# EAGLE design PumpSpark (EAGLE 6.4)

## Sheet 1 of 2
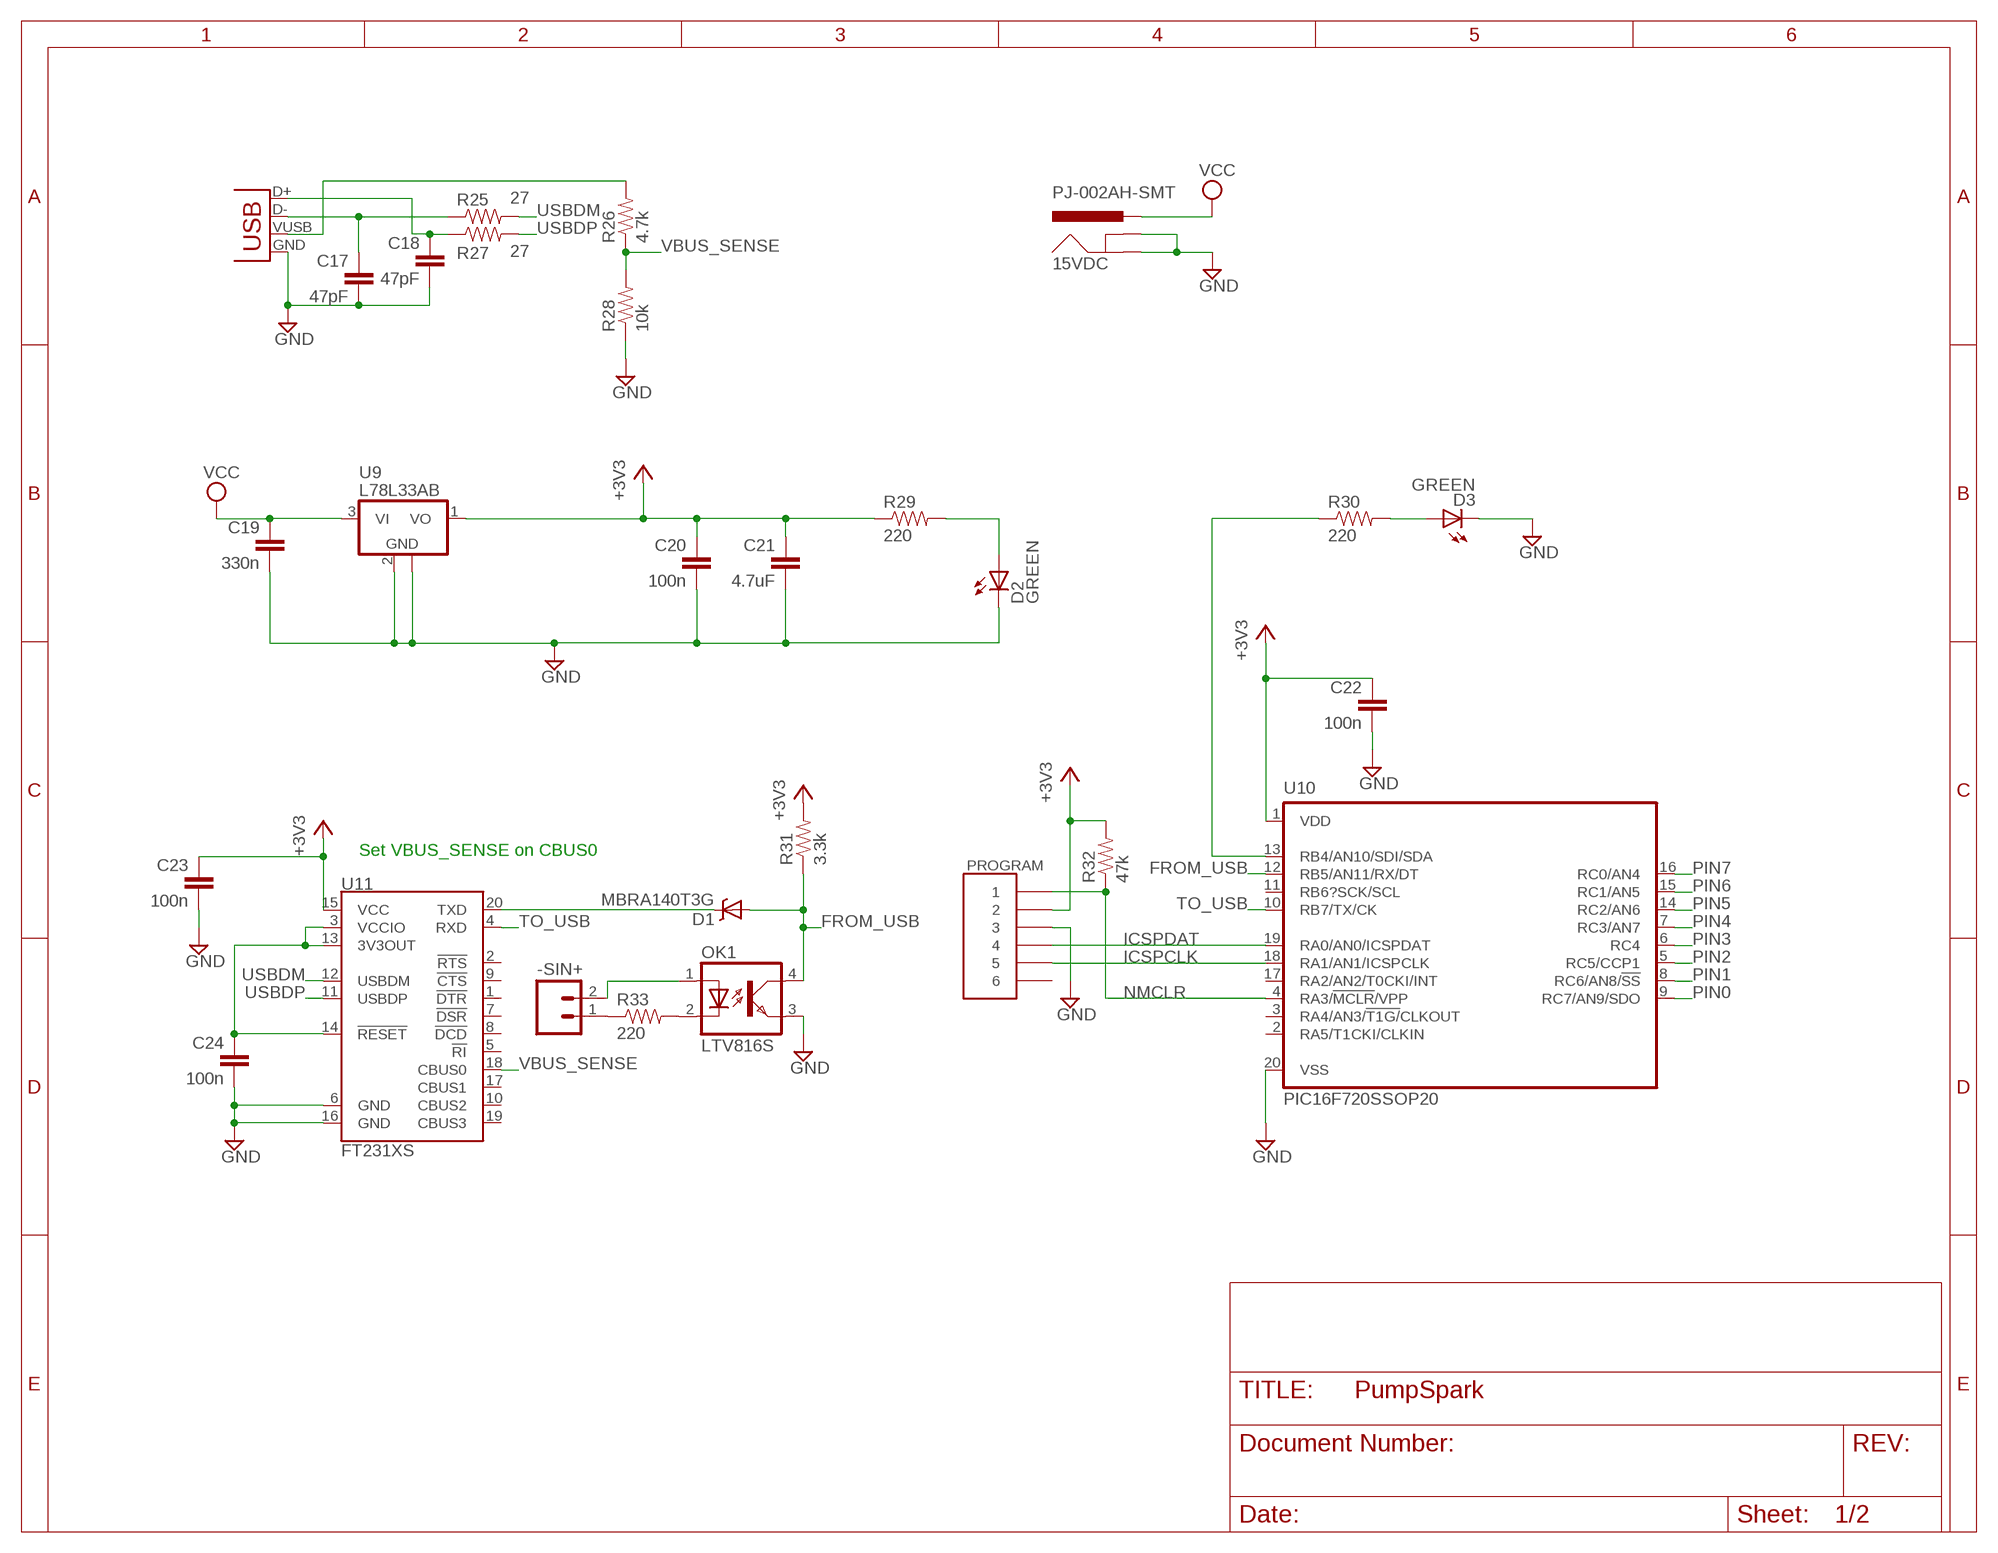
[diagram p0: schematic, sheet 1]

### Parts
15VDC  PJ-002AH-SMT  POWER_JACKSMD  [POWER_JACK_SMD]
-SIN+  M02LOCK  [1X02_LOCK]
C17  47pF  CAP0603-CAP  [0603-CAP]
C18  47pF  CAP0603-CAP  [0603-CAP]
C19  330n  CAP0603-CAP  [0603-CAP]
C20  100n  CAP0603-CAP  [0603-CAP]
C21  4.7uF  CAP0603-CAP  [0603-CAP]
C22  100n  CAP0603-CAP  [0603-CAP]
C23  100n  CAP0603-CAP  [0603-CAP]
C24  100n  CAP0603-CAP  [0603-CAP]
D1  MBRA140T3G  DIODE-SCHOTTKY_  [SMA-DIODE]
D2  GREEN  LED-GREEN0603  [LED-0603]
D3  GREEN  LED-GREEN0603  [LED-0603]
OK1  LTV816S  [SMD4]
PROGRAM  HEADER-6MOLEX-KK  [MOLEX-KK-HEADER-6]
R25  27  RESISTOR0603-RES  [0603-RES]
R26  4.7k  RESISTOR0603-RES  [0603-RES]
R27  27  RESISTOR0603-RES  [0603-RES]
R28  10k  RESISTOR0603-RES  [0603-RES]
R29  220  RESISTOR0603-RES  [0603-RES]
R30  220  RESISTOR0603-RES  [0603-RES]
R31  3.3k  RESISTOR0603-RES  [0603-RES]
R32  47k  RESISTOR0603-RES  [0603-RES]
R33  220  RESISTOR0603-RES  [0603-RES]
U9  L78L33AB  78L05F  [SOT89]
U10  PIC16F720SSOP20  [SSOP20]
U11  FT231XS  [SSOP20_L]
USB  USB-B-S  [USB-B-SMT]

### Nets
+3V3: C20.1 C21.1 C22.1 C23.1 PROGRAM.2 R29.1 R31.2 R32.2 U9.1(VO) U10.1(VDD) U11.15(VCC)
FROM_USB: D1.A OK1.4(COL) R31.1 U10.12(RB5/AN11/RX/DT)
GND: 15VDC.GND(GNDBREAK) 15VDC.P$4(GND) C17.2 C18.2 C19.2 C20.2 C21.2 C22.2 C23.2 C24.2 D2.C D3.C OK1.3(EMIT) PROGRAM.3 R28.1 U9.2(GND) U9.2@1(GND) U10.20(VSS) U11.6(GND) U11.16(GND) USB.GND ; also sheet 2
ICSPCLK: PROGRAM.5 U10.18(RA1/AN1/ICSPCLK)
ICSPDAT: PROGRAM.4 U10.19(RA0/AN0/ICSPDAT)
N$1: OK1.2(C) R33.2
N$2: D1.C U11.20(TXD)
N$3: C24.1 U11.3(VCCIO) U11.13(3V3OUT) U11.14(!RESET)
N$27: D2.A R29.2
N$28: D3.A R30.2
N$29: R26.2 USB.VUSB(VBUS)
N$30: R30.1 U10.13(RB4/AN10/SDI/SDA)
N$35: C17.1 R25.1 USB.D-
N$36: C18.1 R27.1 USB.D+
N$45: -SIN+.1 R33.1
N$46: -SIN+.2 OK1.1(A)
NMCLR: PROGRAM.1 R32.1 U10.4(RA3/!MCLR!/VPP)
PIN0: U10.9(RC7/AN9/SDO) ; also sheet 2
PIN1: U10.8(RC6/AN8/!SS) ; also sheet 2
PIN2: U10.5(RC5/CCP1) ; also sheet 2
PIN3: U10.6(RC4) ; also sheet 2
PIN4: U10.7(RC3/AN7) ; also sheet 2
PIN5: U10.14(RC2/AN6) ; also sheet 2
PIN6: U10.15(RC1/AN5) ; also sheet 2
PIN7: U10.16(RC0/AN4) ; also sheet 2
TO_USB: U10.10(RB7/TX/CK) U11.4(RXD)
USBDM: R25.2 U11.12(USBDM)
USBDP: R27.2 U11.11(USBDP)
VBUS_SENSE: R26.1 R28.2 U11.18(CBUS0)
VCC: 15VDC.VIN0(PWR) C19.1 U9.3(VI) ; also sheet 2
Unconnected: PROGRAM.6 U10.2(RA5/T1CKI/CLKIN) U10.3(RA4/AN3/!T1G/!CLKOUT) U10.11(RB6?SCK/SCL) U10.17(RA2/AN2/T0CKI/INT) U11.1(!DTR) U11.2(!RTS) U11.5(!RI) U11.7(!DSR) U11.8(!DCD) U11.9(!CTS) U11.10(CBUS2) U11.17(CBUS1) U11.19(CBUS3)

### Notes on the sheet
- Set VBUS_SENSE on CBUS0

## Sheet 2 of 2
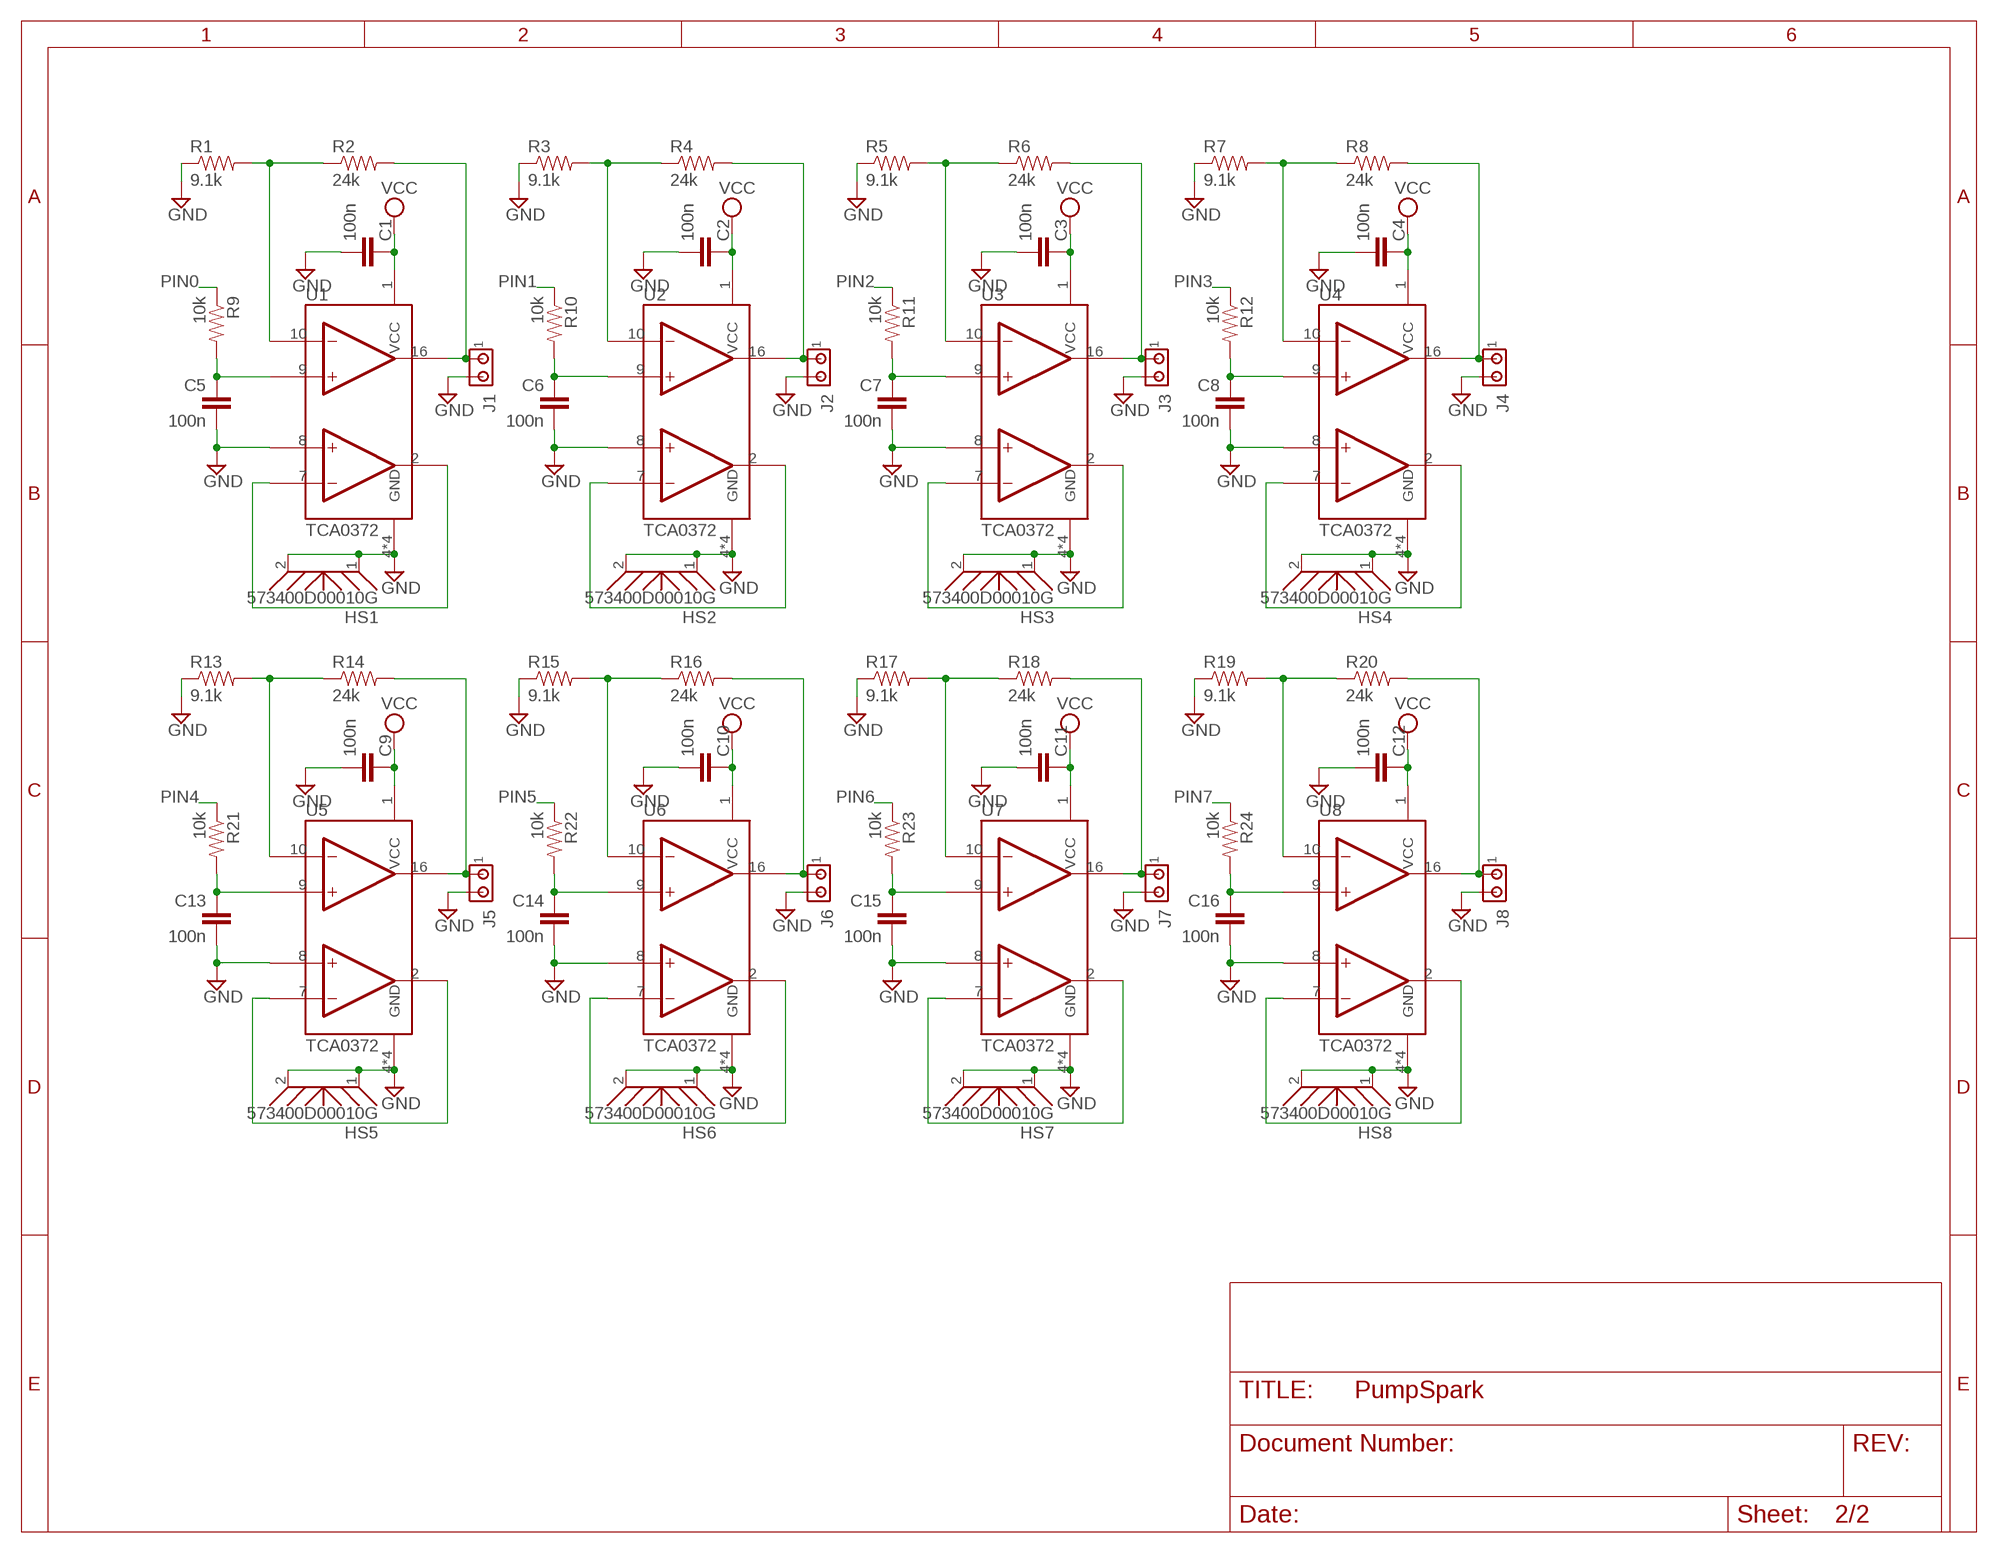
[diagram p1: schematic, sheet 2]

### Parts
C1  100n  CAP0603-CAP  [0603-CAP]
C2  100n  CAP0603-CAP  [0603-CAP]
C3  100n  CAP0603-CAP  [0603-CAP]
C4  100n  CAP0603-CAP  [0603-CAP]
C5  100n  CAP0603-CAP  [0603-CAP]
C6  100n  CAP0603-CAP  [0603-CAP]
C7  100n  CAP0603-CAP  [0603-CAP]
C8  100n  CAP0603-CAP  [0603-CAP]
C9  100n  CAP0603-CAP  [0603-CAP]
C10  100n  CAP0603-CAP  [0603-CAP]
C11  100n  CAP0603-CAP  [0603-CAP]
C12  100n  CAP0603-CAP  [0603-CAP]
C13  100n  CAP0603-CAP  [0603-CAP]
C14  100n  CAP0603-CAP  [0603-CAP]
C15  100n  CAP0603-CAP  [0603-CAP]
C16  100n  CAP0603-CAP  [0603-CAP]
HS1  573400D00010G  [573400D00010G]
HS2  573400D00010G  [573400D00010G]
HS3  573400D00010G  [573400D00010G]
HS4  573400D00010G  [573400D00010G]
HS5  573400D00010G  [573400D00010G]
HS6  573400D00010G  [573400D00010G]
HS7  573400D00010G  [573400D00010G]
HS8  573400D00010G  [573400D00010G]
J1  MTA02-100  [10X02MTA]
J2  MTA02-100  [10X02MTA]
J3  MTA02-100  [10X02MTA]
J4  MTA02-100  [10X02MTA]
J5  MTA02-100  [10X02MTA]
J6  MTA02-100  [10X02MTA]
J7  MTA02-100  [10X02MTA]
J8  MTA02-100  [10X02MTA]
R1  9.1k  RESISTOR0603-RES  [0603-RES]
R2  24k  RESISTOR0603-RES  [0603-RES]
R3  9.1k  RESISTOR0603-RES  [0603-RES]
R4  24k  RESISTOR0603-RES  [0603-RES]
R5  9.1k  RESISTOR0603-RES  [0603-RES]
R6  24k  RESISTOR0603-RES  [0603-RES]
R7  9.1k  RESISTOR0603-RES  [0603-RES]
R8  24k  RESISTOR0603-RES  [0603-RES]
R9  10k  RESISTOR0603-RES  [0603-RES]
R10  10k  RESISTOR0603-RES  [0603-RES]
R11  10k  RESISTOR0603-RES  [0603-RES]
R12  10k  RESISTOR0603-RES  [0603-RES]
R13  9.1k  RESISTOR0603-RES  [0603-RES]
R14  24k  RESISTOR0603-RES  [0603-RES]
R15  9.1k  RESISTOR0603-RES  [0603-RES]
R16  24k  RESISTOR0603-RES  [0603-RES]
R17  9.1k  RESISTOR0603-RES  [0603-RES]
R18  24k  RESISTOR0603-RES  [0603-RES]
R19  9.1k  RESISTOR0603-RES  [0603-RES]
R20  24k  RESISTOR0603-RES  [0603-RES]
R21  10k  RESISTOR0603-RES  [0603-RES]
R22  10k  RESISTOR0603-RES  [0603-RES]
R23  10k  RESISTOR0603-RES  [0603-RES]
R24  10k  RESISTOR0603-RES  [0603-RES]
U1  TCA0372  [SO16W]
U2  TCA0372  [SO16W]
U3  TCA0372  [SO16W]
U4  TCA0372  [SO16W]
U5  TCA0372  [SO16W]
U6  TCA0372  [SO16W]
U7  TCA0372  [SO16W]
U8  TCA0372  [SO16W]

### Nets
GND: C1.2 C2.2 C3.2 C4.2 C5.2 C6.2 C7.2 C8.2 C9.2 C10.2 C11.2 C12.2 C13.2 C14.2 C15.2 C16.2 HS1.1(LEFT) HS1.2(RIGHT) HS2.1(LEFT) HS2.2(RIGHT) HS3.1(LEFT) HS3.2(RIGHT) HS4.1(LEFT) HS4.2(RIGHT) HS5.1(LEFT) HS5.2(RIGHT) HS6.1(LEFT) HS6.2(RIGHT) HS7.1(LEFT) HS7.2(RIGHT) HS8.1(LEFT) HS8.2(RIGHT) J1.2 J2.2 J3.2 J4.2 J5.2 J6.2 J7.2 J8.2 R1.1 R3.1 R5.1 R7.1 R13.1 R15.1 R17.1 R19.1 U1.4(GND) U1.5(GND) U1.8(+INB) U1.12(GND) U1.13(GND) U2.4(GND) U2.5(GND) U2.8(+INB) U2.12(GND) U2.13(GND) U3.4(GND) U3.5(GND) U3.8(+INB) U3.12(GND) U3.13(GND) U4.4(GND) U4.5(GND) U4.8(+INB) U4.12(GND) U4.13(GND) U5.4(GND) U5.5(GND) U5.8(+INB) U5.12(GND) U5.13(GND) U6.4(GND) U6.5(GND) U6.8(+INB) U6.12(GND) U6.13(GND) U7.4(GND) U7.5(GND) U7.8(+INB) U7.12(GND) U7.13(GND) U8.4(GND) U8.5(GND) U8.8(+INB) U8.12(GND) U8.13(GND) ; also sheet 1
N$4: J2.1 R4.2 U2.16(OUTA)
N$5: R3.2 R4.1 U2.10(-INA)
N$6: C5.1 R9.2 U1.9(+INA)
N$7: U2.2(OUTB) U2.7(-INB)
N$8: J3.1 R6.2 U3.16(OUTA)
N$9: R5.2 R6.1 U3.10(-INA)
N$10: C6.1 R10.2 U2.9(+INA)
N$11: U3.2(OUTB) U3.7(-INB)
N$12: J4.1 R8.2 U4.16(OUTA)
N$13: R7.2 R8.1 U4.10(-INA)
N$14: C7.1 R11.2 U3.9(+INA)
N$15: U4.2(OUTB) U4.7(-INB)
N$16: J5.1 R14.2 U5.16(OUTA)
N$17: R13.2 R14.1 U5.10(-INA)
N$18: C8.1 R12.2 U4.9(+INA)
N$19: U5.2(OUTB) U5.7(-INB)
N$20: J6.1 R16.2 U6.16(OUTA)
N$21: R15.2 R16.1 U6.10(-INA)
N$22: C13.1 R21.2 U5.9(+INA)
N$23: U6.2(OUTB) U6.7(-INB)
N$24: J7.1 R18.2 U7.16(OUTA)
N$25: R17.2 R18.1 U7.10(-INA)
N$26: C14.1 R22.2 U6.9(+INA)
N$34: J1.1 R2.2 U1.16(OUTA)
N$37: R1.2 R2.1 U1.10(-INA)
N$38: C15.1 R23.2 U7.9(+INA)
N$39: U1.2(OUTB) U1.7(-INB)
N$40: U7.2(OUTB) U7.7(-INB)
N$41: J8.1 R20.2 U8.16(OUTA)
N$42: R19.2 R20.1 U8.10(-INA)
N$43: C16.1 R24.2 U8.9(+INA)
N$44: U8.2(OUTB) U8.7(-INB)
PIN0: R9.1 ; also sheet 1
PIN1: R10.1 ; also sheet 1
PIN2: R11.1 ; also sheet 1
PIN3: R12.1 ; also sheet 1
PIN4: R21.1 ; also sheet 1
PIN5: R22.1 ; also sheet 1
PIN6: R23.1 ; also sheet 1
PIN7: R24.1 ; also sheet 1
VCC: C1.1 C2.1 C3.1 C4.1 C9.1 C10.1 C11.1 C12.1 U1.1(VCC) U2.1(VCC) U3.1(VCC) U4.1(VCC) U5.1(VCC) U6.1(VCC) U7.1(VCC) U8.1(VCC) ; also sheet 1

## Library data of the parts
15VDC = SparkFun-Connectors:POWER_JACK: Power Jack This is the standard 5.5mm barrel jack for power. The PTH is the most common, proven, reliable, footprint. The Slot footprint only works if the mill layer is transmitted to the PCB fab house so be warned. Spark Fun Electronics SKU : PRT-00119 SMT: CONN-08106 Mating wall wart : TOL-00298 (and others); PROD_ID: CONN-08106; VALUE: 5.5x2.1mm Barrel
-SIN+ = SparkFun-Connectors:M02: Header 2 Standard 2-pin 0.1" header. Use with straight break away headers (SKU : PRT-00116), right angle break away headers (PRT-00553), swiss pins (PRT-00743), machine pins (PRT-00117), and female headers (PRT-00115). Molex polarized connector foot print use with SKU : PRT-08233 with associated crimp pins and housings.
C1-C24 = SparkFun-Capacitors:CAP: Capacitor Standard 0603 ceramic capacitor, and 0.1" leaded capacitor.
D1 = SparkFun-DiscreteSemi:DIODE-SCHOTTKY: Commonly MBRA140.
D2 D3 = SparkFun-LED:LED-GREEN: Various green LEDs 0603- DIO-00821 LARGE- DIO-00862 LILYPAD- DIO-09910; PROD_ID: DIO-00821
HS1-HS8 = phd:573400D00010G
J1-J8 = con-amp:MTA02-100: AMP connector
OK1 = optocoupler:LTV816: OPTO COUPLER Source: LITEON, LTV816.pdf; OC_FARNELL: unknown; OC_NEWARK: unknown
PROGRAM = msft:HEADER-6
R1-R33 = SparkFun-Resistors:RESISTOR: Resistor Basic schematic elements and footprints for 0603, 1206, and PTH resistors.
U1-U8 = phd:TCA0372
U9 = linear:78L*: POSITOIV-VOLTAGE REGULATORS Output up to 100 mA Source: http://focus.ti.com/lit/ds/symlink/ua78l05.pdf
U10 = phd:PIC16F720
U11 = SparkFun-DigitalIC:FT231X: FTDI FT231X Full Speed USB to Full-handshake UART This USB2.0 Full Speed IC offers a compact bridge to full handshake UART interfaces. The device is a UART, capable of operating up to 3MBaud, with low power consumption (8mA). The FT231X includes the complete FT-X series feature set and enables USB to be added into a system design quickly and easily over a UART interface.
USB = SparkFun-Connectors:USB: USB Connectors USB-B-PTH is fully proven SKU : PRT-00139/CONN-08278 USB-miniB is fully proven SKU : PRT-00587 USB-A-PCB is untested. USB-A-H is throughly reviewed, but untested. Spark Fun Electronics SKU : PRT-00437 USB-B-SMT is throughly reviewed, but untested. Needs silkscreen touching up. USB-A-S has not been used/tested USB-MB-H has not been used/tested USB-MICROB has been used. CONN-09505

## Board
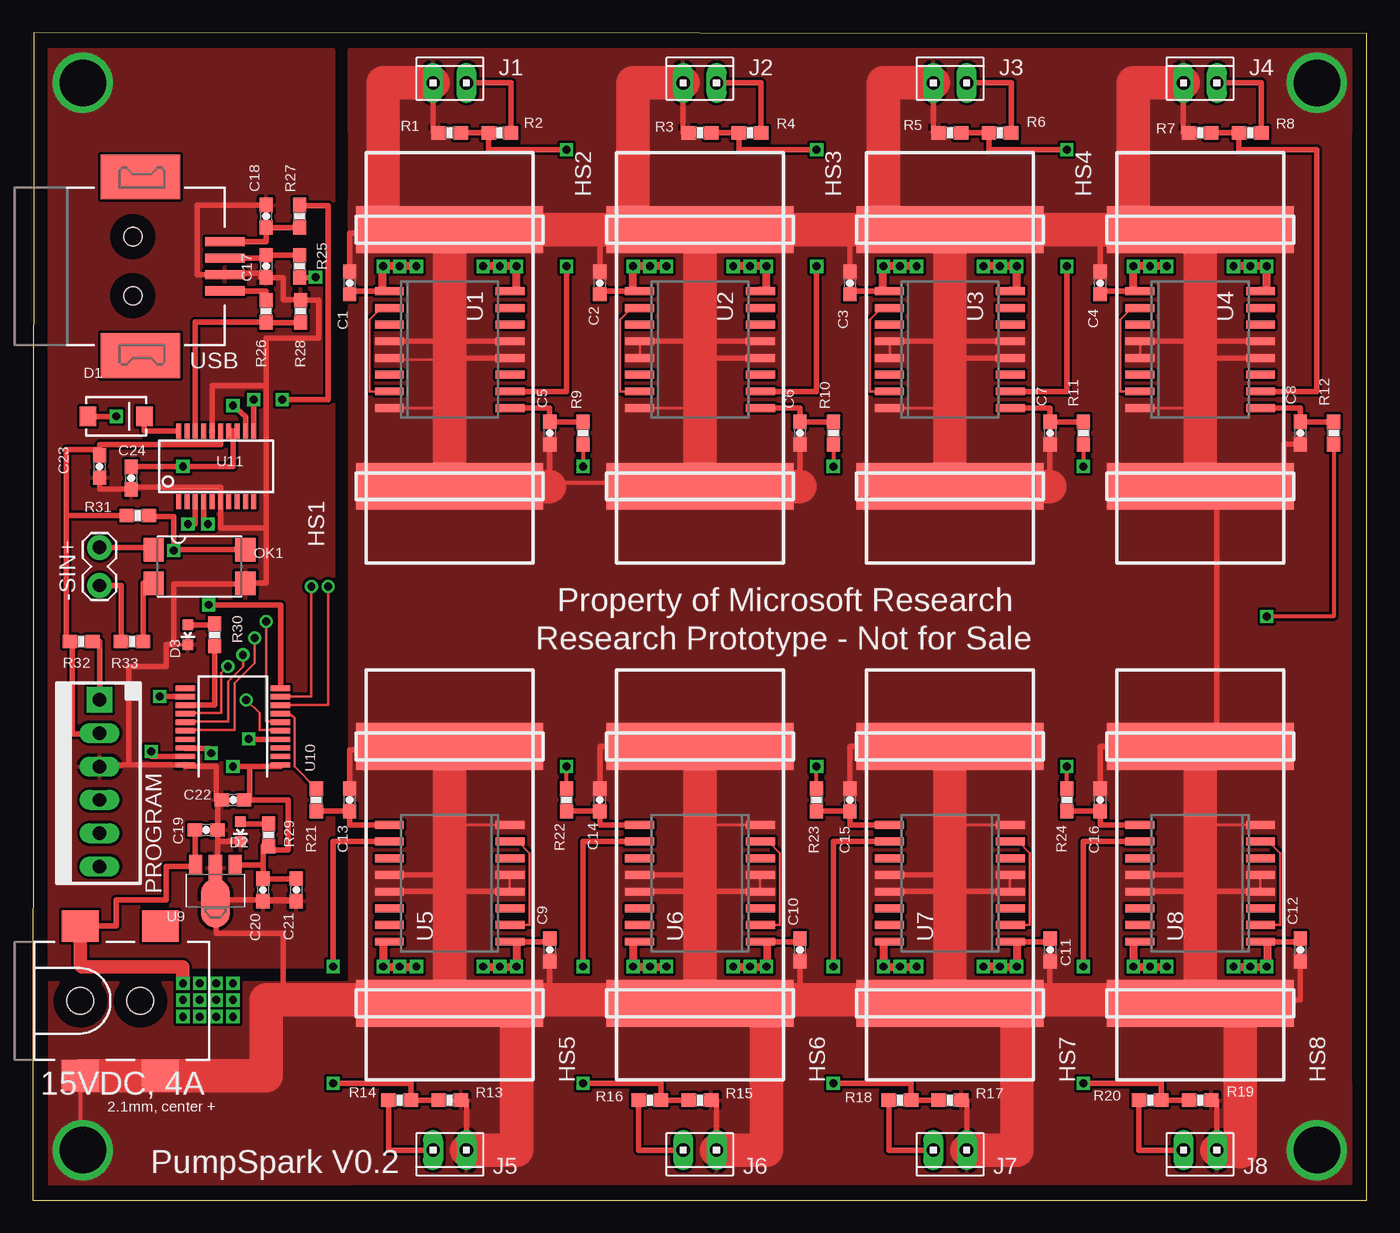
[diagram p2: board, top side]
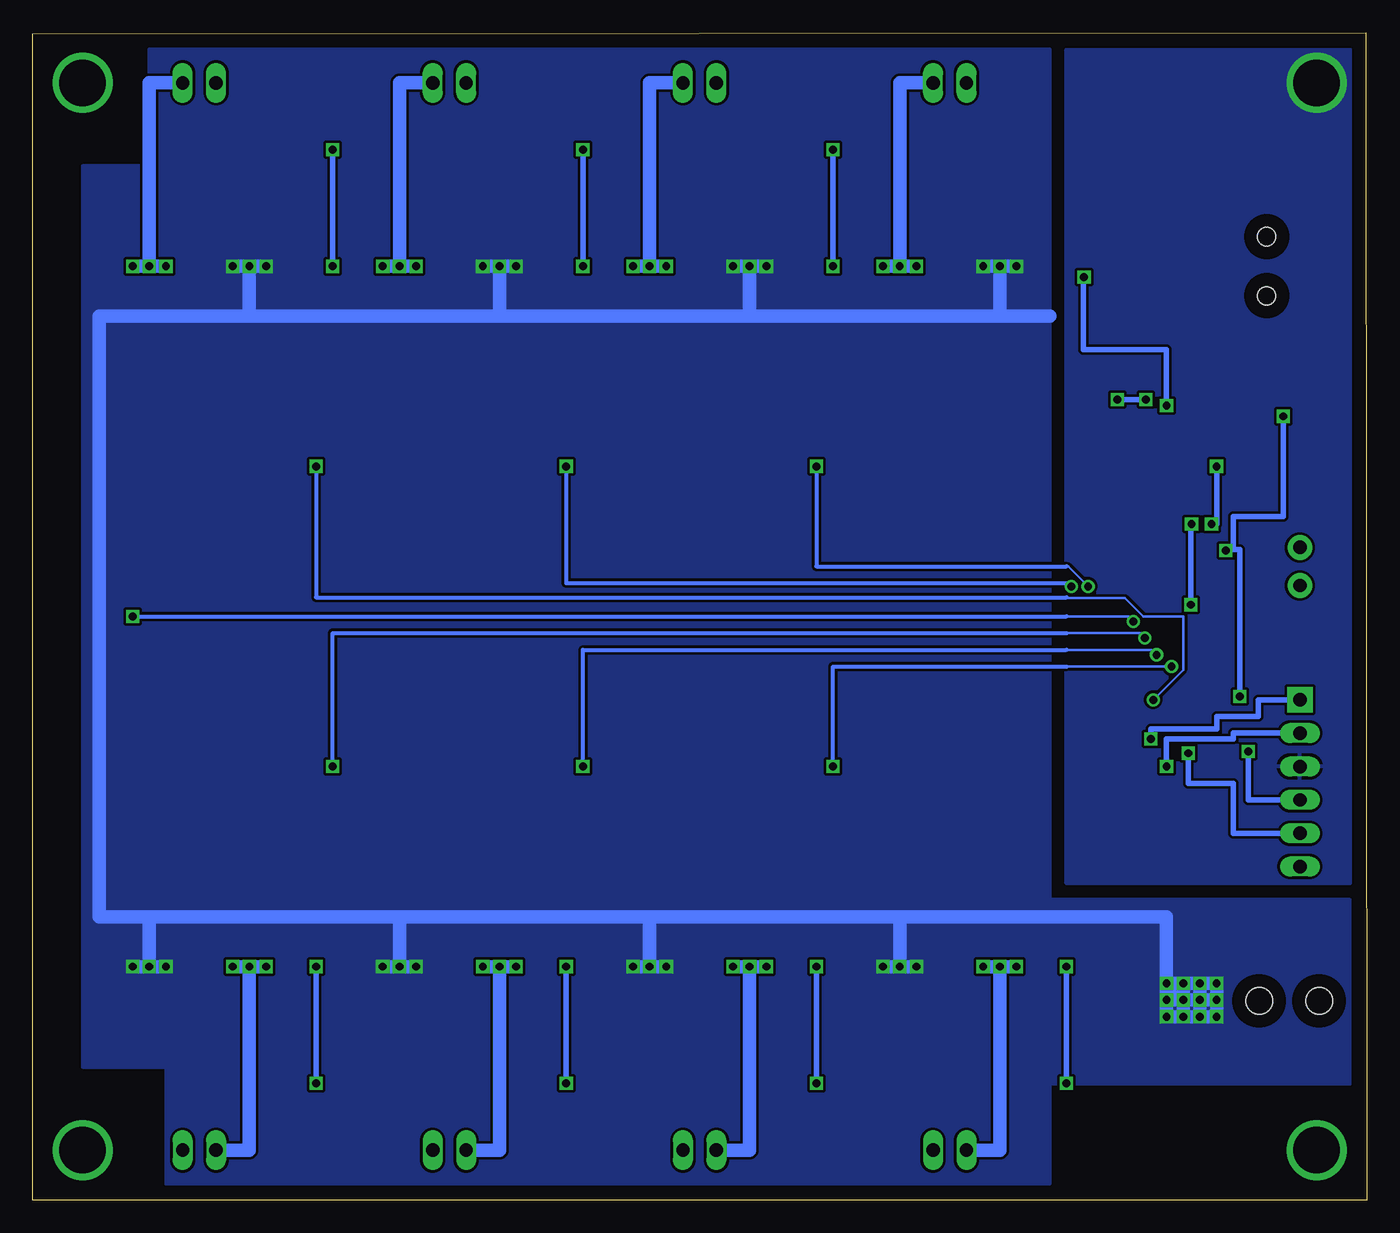
[diagram p3: board, bottom side, seen from below]

Size 101.58 x 88.9 mm. Coordinates in mm from the lower left corner, seen from the top.
Outline: 0,0 101.58,0 101.58,88.82 0.08,88.9 0,0
Copper layers (1*16): Top 0.035mm / dielectric 1.5mm / Bottom 0.035mm
Design rules "default *": minimum track width 8mil, minimum drill 23.5mil, track to track 8mil, track to pad 8mil, pad to pad 8mil, via to via 8mil, smd to smd 8mil, copper to edge 40mil, drill to drill 8mil, minimum pad ring 10mil, minimum via ring 8mil, stop-mask expansion 4mil, vias tented up to drill 0mil, thermal gap 10mil

### Footprints (pad centres in the part's own frame; a part is rotated, then mirrored left to right if it is on the bottom)
POWER_JACK_SMD = smd 2.8 x 2.4: GND 0,-5.7; P$4 6.1,-5.7; VIN0 0,5.7; VIN1 6.1,5.7 | hole 2.032: 0,0; 4.572,0
1X02_LOCK = drill 1.016 pad 1.88: 1 -0.178,0; 2 2.718,0
0603-CAP = smd 1.1 x 1: 1 -0.85,0; 2 0.85,0
SMA-DIODE = smd 1.27 x 1.47: A -2.15,0; C 2.15,0
LED-0603 = smd 0.8 x 0.8: A 0,-0.75; C 0,0.75
573400D00010G = smd 3.556 x 14.224: 1 -0.254,0; 2 19.304,0
10X02MTA = drill 1.016 long: 1 1.27,0; 2 -1.27,0
SMD4 = smd 1.78 x 1.55: 1 -1.27,-3.5; 2 1.27,-3.5; 3 1.27,3.5; 4 -1.27,3.5
MOLEX-KK-HEADER-6 = drill 1.016 pad 1.93 square: 1 0,0 | drill 1.016 long: 2 2.54,0; 3 5.08,0; 4 7.62,0; 5 10.16,0; 6 12.7,0
0603-RES = smd 1.1 x 1: 1 -0.85,0; 2 0.85,0
SO16W = smd 0.6 x 2.2: 1 -4.445,-4.6; 2 -3.175,-4.6; 3 -1.905,-4.6; 4 -0.635,-4.6; 5 0.635,-4.6; 6 1.905,-4.6; 7 3.175,-4.6; 8 4.445,-4.6; 9 4.445,4.6; 10 3.175,4.6; 11 1.905,4.6; 12 0.635,4.6; 13 -0.635,4.6; 14 -1.905,4.6; 15 -3.175,4.6; 16 -4.445,4.6
SOT89 = smd 1 x 1.5: 1 -1.499,-1.981; 3 1.499,-1.981 | smd 1 x 2: 2 0,-1.727 | smd 2.2 x 3.7: 2@1 0,0.94
SSOP20 = smd 0.4 x 1.5: 1 0.885,0.185; 2 1.535,0.185; 3 2.185,0.185; 4 2.835,0.185; 5 3.485,0.185; 6 4.135,0.185; 7 4.785,0.185; 8 5.435,0.185; 9 6.085,0.185; 10 6.735,0.185; 11 6.735,7.435; 12 6.085,7.435; 13 5.435,7.435; 14 4.785,7.435; 15 4.135,7.435; 16 3.485,7.435; 17 2.835,7.435; 18 2.185,7.435; 19 1.535,7.435; 20 0.885,7.435
SSOP20_L = smd 0.381 x 1.143: 1 -2.857,-2.68; 2 -2.223,-2.68; 3 -1.587,-2.68; 4 -0.953,-2.68; 5 -0.318,-2.68; 6 0.318,-2.68; 7 0.953,-2.68; 8 1.587,-2.68; 9 2.223,-2.68; 10 2.857,-2.68; 11 2.857,2.68; 12 2.223,2.68; 13 1.587,2.68; 14 0.953,2.68; 15 0.318,2.68; 16 -0.318,2.68; 17 -0.953,2.68; 18 -1.587,2.68; 19 -2.223,2.68; 20 -2.857,2.68
USB-B-SMT = smd 6.04 x 3.4: 5 0.58,6.8; 6 0.58,-6.8 | smd 3 x 0.7: D+ 7,1.875; D- 7,0.625; GND 7,-0.625; VUSB 7,-1.875 | hole 1.4: 0,2.25; 0,-2.25

### Placement (x,y rotation side)
15VDC  3.62,15.18 0 top
-SIN+  5.08,46.99 90 top
C1  24.13,69.85 90 top
C2  43.18,69.85 90 top
C3  62.23,69.85 90 top
C4  81.28,69.85 90 top
C5  39.37,58.42 270 top
C6  58.42,58.42 270 top
C7  77.47,58.42 270 top
C8  96.52,58.42 270 top
C9  39.37,19.05 270 top
C10  58.42,19.05 270 top
C11  77.47,19.05 270 top
C12  96.52,19.05 270 top
C13  24.13,30.48 90 top
C14  43.18,30.48 90 top
C15  62.23,30.48 90 top
C16  81.28,30.48 90 top
C17  17.78,71.12 270 top
C18  17.78,74.93 90 top
C19  13.21,28.19 0 top
C20  17.53,23.62 270 top
C21  20.07,23.62 270 top
C22  15.24,30.48 180 top
C23  5.08,55.88 270 top
C24  7.49,54.99 270 top
D1  6.35,59.69 0 top
D2  15.81,28.07 180 top
D3  11.81,43.05 180 top
HS1  31.75,73.66 270 top
HS2  50.8,73.66 270 top
HS3  69.85,73.66 270 top
HS4  88.9,73.66 270 top
HS5  31.75,15.24 90 top
HS6  50.8,15.24 90 top
HS7  69.85,15.24 90 top
HS8  88.9,15.24 90 top
J1  31.75,85.09 0 top
J2  50.8,85.09 0 top
J3  69.85,85.09 0 top
J4  88.9,85.09 0 top
J5  31.75,3.81 180 top
J6  50.8,3.81 180 top
J7  69.85,3.81 180 top
J8  88.9,3.81 180 top
OK1  12.7,48.26 270 top
PROGRAM  5.08,38.1 270 top
R1  31.75,81.28 0 top
R2  35.56,81.28 0 top
R3  50.8,81.28 0 top
R4  54.61,81.28 0 top
R5  69.85,81.28 0 top
R6  73.66,81.28 0 top
R7  88.9,81.28 0 top
R8  92.71,81.28 0 top
R9  41.91,58.42 90 top
R10  60.96,58.42 90 top
R11  80.01,58.42 90 top
R12  99.06,58.42 90 top
R13  31.75,7.62 180 top
R14  27.94,7.62 180 top
R15  50.8,7.62 180 top
R16  46.99,7.62 180 top
R17  69.85,7.62 180 top
R18  66.04,7.62 180 top
R19  88.9,7.62 180 top
R20  85.09,7.62 180 top
R21  21.59,30.48 270 top
R22  40.64,30.48 270 top
R23  59.69,30.48 270 top
R24  78.74,30.48 270 top
R25  20.32,71.12 270 top
R26  17.78,67.69 90 top
R27  20.32,74.93 90 top
R28  20.38,67.69 270 top
R29  17.97,27.81 90 top
R30  13.84,43.05 90 top
R31  8,52.13 180 top
R32  3.68,42.55 180 top
R33  7.56,42.55 0 top
U1  31.75,64.77 270 top
U2  50.8,64.77 270 top
U3  69.85,64.77 270 top
U4  88.9,64.77 270 top
U5  31.75,24.13 90 top
U6  50.8,24.13 90 top
U7  69.85,24.13 90 top
U8  88.9,24.13 90 top
U9  13.91,23.56 180 top
U10  19.05,32.26 90 top
U11  13.97,55.88 0 top
USB  7.62,71.12 0 top

### Tracks (layer width: path | path; a pad name or v marks a point on that pad's centre or on a via)
+3V3  (via drill 0.6)
  Top 0.203: 16.51,30.48 C22.1 | 4.95,57.15 C23.1
  Top 0.406: U9.1 17.53,25.54 | 17.53,25.54 C20.1 C21.1 | 17.53,25.54 17.53,26.96 R29.1 17.97,26.67 19.43,26.67 19.43,30.48 16.51,30.48 16.51,33.02 | 16.51,33.02 18.86,33.02 U10.1 | PROGRAM.2 5.08,35.5 2.98,35.5 2.98,42.55 R32.2 2.54,42.55 2.54,52.13 | 2.54,52.13 2.54,57.15 4.95,57.15 5.08,57.15 | U11.15 14.29,57.53 5.08,57.53 C23.1 | R31.2 2.54,52.13 | 16.51,33.02 v15.24,33.02
  Bottom 0.406: PROGRAM.2 10.16,35.56 10.16,35.12 15.24,35.12 v15.24,33.02
FROM_USB  (via drill 0.6)
  Top 0.406: OK1.4 10.73,49.53 | 10.73,49.53 10.73,52.07 8.85,52.07 R31.1 | U10.12 10.41,38.34 v9.65,38.35 | v10.73,49.47 10.73,49.53 | D1.A v6.35,59.69
  Bottom 0.406: v9.65,38.35 9.65,49.53 10.16,49.53 | 10.16,49.53 10.73,49.53 v10.73,49.47 | v6.35,59.69 6.35,52.07 10.16,52.07 10.16,49.53
GND  (via drill 3.56)
  Top 0.203: D3.C 10.92,42.29 10.73,42.3 | 14.61,70.48 USB.GND | U5.5 36.32,24.77 36.32,23.62 U5.4 | 31.75,64.01 27.18,64.01 27.18,64.14 U1.5 | 31.75,28.57 U5.8 | U6.5 55.37,24.77 55.37,23.62 U6.4 | 50.8,28.57 U6.8 | U7.5 74.42,24.77 74.42,23.62 U7.4 | 69.85,28.57 U7.8 | 31.75,60.33 U1.8 | 50.8,60.33 U2.8 | U2.5 46.23,64.14 46.23,65.28 U2.4 | U8.5 93.47,24.77 93.47,23.62 U8.4 | 88.9,28.57 U8.8 | 69.85,60.33 U3.8 | U3.5 65.28,64.14 65.28,65.28 U3.4 | 88.9,60.33 U4.8 | U4.5 84.33,64.14 84.33,65.28 U4.4 | 13.97,30.61 C22.2 | HS3.2 69.85,54.61
  Top 0.305: HS2.2 50.8,54.61 39.37,54.61 | 15VDC.GND 3.62,3.81 v3.81,3.81
  Top 0.406: 13.97,30.48 13.97,30.61 13.97,33.02 11.62,33.02 U10.20 7.3,33.14 | 7.3,33.14 5.08,33.14 PROGRAM.3 | 17.78,51.18 14.29,51.18 U11.6 14.29,54.29 7.49,54.29 C24.2 5.08,54.14 C23.2 | 17.78,51.18 17.78,46.99 OK1.3 16.2,46.93 10.73,46.93 10.73,42.3 10.16,42.3 10.16,40.64 7.3,40.64 7.3,33.14 | 17.78,62.04 17.78,65.66 21.78,65.66 21.78,68.54 R28.1 20.38,68.58 19.05,68.58 19.05,70.27 C17.2 17.34,70.27 17.34,70.61 14.62,70.61 USB.GND | 17.78,62.04 17.78,51.18 | 17.78,62.04 13.65,62.04 U11.16 | U5.13 31.75,23.5 U5.4 | 13.97,22.62 13.97,20.32 19.05,20.32 19.05,15.24 | 32.6,3.81 J5.2 33.02,7.62 R13.1 | C18.2 12.51,75.78 12.51,70.48 14.61,70.48 14.62,70.48 | C20.2 C21.2 20.07,22.86 13.97,22.86 13.97,22.77 | 13.97,22.77 13.97,22.62 | 13.97,22.62 U9.2@1 | U9.2 13.91,25.4 13.97,25.4 | U9.2@1 13.91,22.77 13.97,22.77 | U9.2 U9.2@1 | 14.06,27.3 C19.2 14.06,30.48 C22.2 | 14.06,27.3 14.06,25.29 U9.2 | D2.C 15.81,27.3 14.06,27.3 | U1.4 31.75,65.41 | 31.75,65.41 31.75,66.04 | U1.13 31.75,65.41 | 31.75,65.41 31.75,64.77 | U1.12 31.75,64.14 31.75,64.01 | R15.1 52.07,7.62 J6.2 | R17.1 71.12,7.62 J7.2 | J8.2 90.17,7.62 R19.1 | J4.2 87.63,81.28 R7.1 | J3.2 68.58,81.28 R5.1 | J2.2 49.53,81.28 R3.1 | J1.2 30.48,81.28 R1.1 | C5.2 39.37,54.61 39.37,54.36 | C6.2 58.42,54.36 | C7.2 77.47,54.36 | C8.2 95.25,57.57 95.25,54.61 90.17,54.61 90.17,34.29 88.9,34.29 HS8.2 81.28,34.54 C16.2 | U2.4 50.8,65.41 | 50.8,65.41 50.8,66.04 | U3.4 69.85,65.41 | 69.85,65.41 69.85,66.04 | U4.4 88.9,65.41 | U2.13 50.8,65.41 | 50.8,65.41 50.8,64.77 | U2.12 50.8,64.14 50.8,63.5 | U3.13 69.85,65.41 | 69.85,65.41 69.85,64.77 | U3.12 69.85,64.14 69.85,63.5 | U4.13 88.9,65.41 | 88.9,65.41 88.9,66.04
  Top 0.406: U4.12 88.9,64.14 88.9,63.5 | U5.12 31.75,24.77 31.75,24.13 | U6.13 50.8,23.5 | U6.12 50.8,24.77 50.8,24.13 | U6.4 50.8,23.5 | 50.8,23.5 50.8,22.86 | U7.13 69.85,23.5 | 69.85,23.5 69.85,24.13 69.85,24.77 U7.12 | U7.4 69.85,23.5 | 69.85,23.5 69.85,22.86 | U8.13 88.9,23.5 | U8.12 88.9,24.77 88.9,25.4 | U8.4 88.9,23.5 | 88.9,23.5 88.9,22.86 | C9.2 39.37,15.24 | C10.2 58.42,15.24 | C12.2 96.52,15.24 91.95,15.11 93.98,14.99 HS8.1 | C4.2 81.28,73.91 | C3.2 62.23,73.91 | C11.2 77.47,15.24 | 43.18,73.91 43.18,73.66 | 43.18,73.66 45.72,73.66 | C13.2 24.13,34.29 25.4,34.29 25.4,34.54 HS5.2 | C14.2 43.18,34.54 HS6.2 | C15.2 62.23,34.54 HS7.2 | C2.2 43.18,73.66 | C1.2 24.13,73.66 26.67,73.66 31.75,73.66 HS1.1
  Top 2.54: 15VDC.GND 15VDC.P$4 17.78,9.48 17.78,15.24 19.05,15.24 31.75,15.24 | 31.75,15.24 HS5.1 31.75,23.5 31.75,24.13 31.75,28.57 HS5.2 | 31.75,15.24 36.83,15.24 | 36.83,15.24 39.37,15.24 50.8,15.24 | 50.8,15.24 HS6.1 50.8,22.86 50.8,24.13 50.8,28.57 HS6.2 | 50.8,15.24 55.88,15.24 | 55.88,15.24 58.42,15.24 69.85,15.24 | 69.85,15.24 HS7.1 69.85,22.86 69.85,24.13 69.85,28.57 HS7.2 | 69.85,15.24 74.93,15.24 | 74.93,15.24 77.47,15.24 88.9,15.24 HS8.1 88.9,22.86 88.9,25.4 88.9,28.57 HS8.2 | J5.2 36.83,3.81 36.83,15.24 | J6.2 55.88,3.81 55.88,15.24 | J7.2 74.93,3.81 74.93,15.24 | J8.2 91.95,3.68 91.95,15.11 | 39.37,54.36 HS1.2 31.75,60.33 31.75,64.01 31.75,64.77 31.75,66.04 HS1.1 43.18,73.91 HS2.1 | HS2.2 58.42,54.36 | HS3.2 77.47,54.36 | 90.17,54.61 88.9,54.61 | 88.9,54.61 HS4.2 | HS3.1 64.77,73.91 | 64.77,73.91 62.23,73.91 HS2.1 | 83.82,73.91 HS4.1 88.9,66.04 88.9,63.5 88.9,60.33 88.9,54.61 | 83.82,73.91 81.28,73.91 HS3.1 | HS2.1 50.8,66.04 50.8,64.77 50.8,63.5 50.8,60.33 50.8,54.61 | HS3.1 69.85,66.04 69.85,64.77 69.85,63.5 69.85,60.33 69.85,54.61 | J1.2 26.67,85.09 26.67,73.66 | J2.2 45.72,85.09 45.72,73.66 | J3.2 64.77,85.09 64.77,73.91 | J4.2 83.82,85.09 83.82,73.91
  other vias: 97.79,85.09 3.81,85.09 97.79,3.81
  pour Top (no thermals): 100.33,81.28 24.13,81.28 24.13,8.89 100.33,8.89
  pour Top: 1.27,17.78 1.27,87.63 22.86,87.63 22.86,17.78
  pour Bottom: 1.27,24.13 22.86,24.13 22.86,87.63 1.27,87.63
  pour Top: 24.13,87.63 100.33,87.63 100.33,81.28 24.13,81.28
  pour Top: 100.33,8.89 100.33,1.27 24.13,1.27 24.13,8.89
  pour Top (no thermals): 1.27,1.27 24.13,1.27 24.13,16.51 1.27,16.51
ICSPCLK  (via drill 0.6)
  Top 0.406: U10.18 11.62,34.42 13.46,34.42 13.46,34.04 v13.59,34.04
  Bottom 0.406: v13.59,34.04 13.59,31.75 10.16,31.75 10.16,27.94 PROGRAM.5
ICSPDAT  (via drill 0.6)
  Top 0.406: U10.19 9.02,33.78 v9.02,34.16
  Bottom 0.406: v9.02,34.16 9.02,30.48 PROGRAM.4
N$1
  Top 0.406: OK1.2 8.41,46.99 R33.2
N$2
  Top 0.406: D1.C 8.5,58.56 U11.20
N$3  (via drill 0.6)
  Top 0.406: U11.13 U11.14 15.24,58.56 15.24,55.88 v11.43,55.88 7.49,55.88 C24.1 | v11.81,51.5 12.38,51.5 U11.3
  Bottom 0.406: v11.43,55.88 11.43,51.5 v11.81,51.5
N$4  (via drill 0.6)
  Top 0.406: R4.2 55.46,85.09 J2.1
  Top 0.61: U2.16 55.4,69.28 55.88,69.28 v55.88,71.12 v53.34,71.12
  Bottom 1.016: v53.34,71.12 v54.61,71.12 | v54.61,71.12 v55.88,71.12 | J2.1 54.61,85.09 v54.61,71.12
N$5  (via drill 0.6)
  Top 0.406: R3.2 R4.1 53.76,80.01 v59.69,80.01 | U2.10 59.69,61.59 v59.69,71.12
  Bottom 0.406: v59.69,71.12 v59.69,80.01
N$6
  Top 0.406: U1.9 39.37,60.33 C5.1 R9.2
N$7
  Top 0.203: U2.7 44.7,61.59 44.7,67.06 45.59,67.94 U2.2
N$8  (via drill 0.6)
  Top 0.406: R6.2 74.51,85.09 J3.1
  Top 0.61: U3.16 74.45,69.28 74.93,69.28 v74.93,71.12 v72.39,71.12
  Bottom 1.016: v72.39,71.12 v73.66,71.12 | v73.66,71.12 v74.93,71.12 | J3.1 73.66,85.09 v73.66,71.12
N$9  (via drill 0.6)
  Top 0.406: R5.2 R6.1 72.81,80.01 v78.74,80.01 | U3.10 78.74,61.59 v78.74,71.12
  Bottom 0.406: v78.74,71.12 v78.74,80.01
N$10
  Top 0.406: U2.9 58.42,60.33 C6.1 R10.2
N$11
  Top 0.203: U3.7 63.75,61.59 63.75,67.06 64.64,67.94 U3.2
N$12  (via drill 0.6)
  Top 0.406: R8.2 93.56,85.09 J4.1
  Top 0.61: U4.16 93.5,69.28 93.98,69.28 v93.98,71.12 v91.44,71.12
  Bottom 1.016: v91.44,71.12 v92.71,71.12 | v92.71,71.12 v93.98,71.12 | J4.1 92.71,85.09 v92.71,71.12
N$13
  Top 0.406: R7.2 R8.1 91.86,80.01 97.79,80.01 97.79,61.59 U4.10
N$14
  Top 0.406: U3.9 77.47,60.33 C7.1 R11.2
N$15
  Top 0.203: U4.7 82.8,61.59 82.8,67.06 83.69,67.94 U4.2
N$16  (via drill 0.6)
  Top 0.406: R14.2 27.09,3.81 J5.1
  Top 0.61: U5.16 26.67,19.68 v26.67,17.78 v29.21,17.78
  Bottom 1.016: v29.21,17.78 v27.94,17.78 | v27.94,17.78 v26.67,17.78 | J5.1 27.94,3.81 v27.94,17.78
N$17  (via drill 0.6)
  Top 0.406: R13.2 R14.1 28.79,8.89 v22.86,8.89 | U5.10 22.86,27.3 v22.86,17.78
  Bottom 0.406: v22.86,17.78 v22.86,8.89
N$18
  Top 0.406: U4.9 96.52,60.33 C8.1 R12.2
N$19
  Top 0.203: U5.2 37.85,20.95 37.85,26.42 36.96,27.3 U5.7
N$20  (via drill 0.6)
  Top 0.406: R16.2 46.14,3.81 J6.1
  Top 0.61: U6.16 45.72,19.68 v45.72,17.78 v48.26,17.78
  Bottom 1.016: v48.26,17.78 v46.99,17.78 | v46.99,17.78 v45.72,17.78 | J6.1 46.99,3.81 v46.99,17.78
N$21  (via drill 0.6)
  Top 0.406: R15.2 R16.1 47.84,8.89 v41.91,8.89 | U6.10 41.91,27.3 v41.91,17.78
  Bottom 0.406: v41.91,17.78 v41.91,8.89
N$22
  Top 0.406: R21.2 C13.1 24.13,28.57 U5.9
N$23
  Top 0.203: U6.2 56.9,20.95 56.9,26.42 56.01,27.3 U6.7
N$24  (via drill 0.6)
  Top 0.406: R18.2 65.19,3.81 J7.1
  Top 0.61: U7.16 64.77,19.68 v64.77,17.78 v67.31,17.78
  Bottom 1.016: v67.31,17.78 v66.04,17.78 | v66.04,17.78 v64.77,17.78 | J7.1 66.04,3.81 v66.04,17.78
N$25  (via drill 0.6)
  Top 0.406: R17.2 R18.1 66.89,8.89 v60.96,8.89 | U7.10 60.96,27.3 v60.96,17.78
  Bottom 0.406: v60.96,17.78 v60.96,8.89
N$26
  Top 0.406: R22.2 C14.1 43.18,28.57 U6.9
N$27
  Top 0.406: D2.A 15.81,28.66 R29.2
N$28
  Top 0.406: D3.A 13.84,43.8 R30.2
N$29
  Top 0.406: USB.VUSB 17.78,69.25 R26.2
N$30
  Top 0.406: U10.13 13.84,37.69 R30.1
N$34  (via drill 0.6)
  Top 0.406: R2.2 36.41,85.09 J1.1
  Top 0.61: U1.16 36.83,69.22 v36.83,71.12 v34.29,71.12
  Bottom 1.016: v34.29,71.12 v35.56,71.12 | v35.56,71.12 v36.83,71.12 | J1.1 35.56,85.09 v35.56,71.12
N$35
  Top 0.406: USB.D- 17.78,71.75 C17.1 R25.1
N$36
  Top 0.406: USB.D+ 17.78,73 C18.1 R27.1
N$37  (via drill 0.6)
  Top 0.406: R1.2 R2.1 34.71,80.01 v40.64,80.01 | U1.10 40.64,61.59 v40.64,71.12
  Bottom 0.406: v40.64,71.12 v40.64,80.01
N$38
  Top 0.406: R23.2 C15.1 62.23,28.57 U7.9
N$39
  Top 0.203: U1.7 25.65,61.59 25.65,67.06 26.54,67.94 U1.2
N$40
  Top 0.203: U7.2 75.95,20.95 75.95,26.42 75.06,27.3 U7.7
N$41  (via drill 0.6)
  Top 0.406: R20.2 84.24,3.81 J8.1
  Top 0.61: U8.16 83.82,19.68 v83.82,17.78 v86.36,17.78
  Bottom 1.016: v86.36,17.78 v85.09,17.78 | v85.09,17.78 v83.82,17.78 | J8.1 85.09,3.81 v85.09,17.78
N$42  (via drill 0.6)
  Top 0.406: R19.2 R20.1 85.94,8.89 v80.01,8.89 | U8.10 80.01,27.3 v80.01,17.78
  Bottom 0.406: v80.01,17.78 v80.01,8.89
N$43
  Top 0.406: R24.2 C16.1 81.28,28.57 U8.9
N$44
  Top 0.203: U8.2 95,20.95 95,26.42 94.11,27.3 U8.7
N$45
  Top 0.406: R33.1 6.73,42.55 6.73,46.8 -SIN+.1
N$46
  Top 0.406: -SIN+.2 9.2,49.71 OK1.1
N$47
  pour Top: 24.13,72.39 24.13,76.2 39.37,76.2 39.37,72.07 24.13,72.07 24.13,72.26
NMCLR  (via drill 0.6)
  Top 0.406: R32.1 5.08,42.55 PROGRAM.1 | v16.45,35.12 16.45,35.09 U10.4
  Bottom 0.406: PROGRAM.1 8.26,38.1 8.26,36.83 11.43,36.83 11.43,35.88 16.45,35.88 v16.45,35.12
PIN0  (via drill 0.6)
  Top 0.203: v21.21,46.74 21.21,38.35 18.92,38.35 U10.9
  Top 0.305: R9.1 v41.91,55.88
  Bottom 0.203: v21.21,46.74 22.73,48.26 22.86,48.26
  Bottom 0.305: v41.91,55.88 41.91,48.26 22.86,48.26
PIN1  (via drill 0.6)
  Top 0.203: v22.48,46.74 22.48,37.72 18.92,37.72 U10.8
  Top 0.305: R10.1 v60.96,55.88
  Bottom 0.203: v22.48,46.74 22.73,46.99 22.86,46.99
  Bottom 0.305: v60.96,55.88 60.96,46.99 22.86,46.99
PIN2  (via drill 0.6)
  Top 0.203: v16.26,38.1 17.27,37.08 17.27,35.81 18.8,35.81 U10.5
  Top 0.305: R11.1 v80.01,55.88
  Bottom 0.203: v16.26,38.1 13.97,40.39 13.97,44.45 17.02,44.45 18.41,45.85 22.73,45.85 22.86,45.91
  Bottom 0.305: v80.01,55.88 80.01,45.91 22.86,45.91
PIN3  (via drill 0.6)
  Top 0.203: v17.78,44.07 17.78,36.45 18.8,36.45 U10.6
  Top 0.305: R12.1 99.06,44.45 v93.98,44.45
  Bottom 0.203: v17.78,44.07 18.16,44.45 22.86,44.45
  Bottom 0.305: v93.98,44.45 22.86,44.45
PIN4
  Top 0.203: R21.1 21.59,31.37 19.94,33.02 19.94,36.7 19.68,36.96 18.92,36.96 U10.7
PIN5  (via drill 0.6)
  Top 0.203: v14.86,40.64 14.35,40.13 14.35,37.08 11.68,37.08 U10.14
  Top 0.305: R22.1 v40.64,33.02
  Bottom 0.203: 22.86,40.64 v14.86,40.64
  Bottom 0.305: v40.64,33.02 40.64,40.64 22.86,40.64
PIN6  (via drill 0.6)
  Top 0.203: v16,41.53 16,40.64 14.86,39.5 14.86,36.45 11.68,36.45 U10.15
  Top 0.305: R23.1 v59.69,33.02
  Bottom 0.203: v16,41.53 16.38,41.91 22.86,41.91
  Bottom 0.305: v59.69,33.02 59.69,41.91 22.86,41.91
PIN7  (via drill 0.6)
  Top 0.203: v16.89,42.8 16.89,40.89 15.37,39.37 15.37,35.81 11.68,35.81 U10.16
  Top 0.305: R24.1 v78.74,33.02
  Bottom 0.203: v16.89,42.8 17.27,43.18 22.86,43.18
  Bottom 0.305: v78.74,33.02 78.74,43.18 22.86,43.18
TO_USB  (via drill 0.6)
  Top 0.406: U11.4 13.02,51.5 v13.34,51.5 | v13.4,45.34 18.86,45.34 U10.10
  Bottom 0.406: v13.34,51.5 13.4,51.5 v13.4,45.34
USBDM  (via drill 0.6)
  Top 0.406: R25.2 21.65,70.27 v21.53,70.29 | v15.24,60.52 16.19,59.69 U11.12
  Bottom 0.406: v21.53,70.29 21.59,70.29 21.59,64.77 15.24,64.77 v15.24,60.52
USBDP  (via drill 0.6)
  Top 0.406: U11.11 v16.83,60.96 | v18.99,60.96 22.48,60.96 22.48,75.75 20.32,75.75 R27.2
  Bottom 0.406: v16.83,60.96 v18.99,60.96
VBUS_SENSE
  Top 0.406: R28.2 R26.1 17.78,66.86 12.38,66.86 U11.18
VCC  (via drill 0.6)
  Top 0.203: U9.3 12.45,25.53 12.41,25.4
  Top 0.406: 15VDC.VIN0 6.35,20.88 6.35,22.86 10.16,22.86 10.16,25.4 12.41,25.4 | C19.1 12.36,25.54 U9.3 | C1.1 24.13,69.22 26.61,69.22 U1.1 | C2.1 43.18,69.22 45.66,69.22 U2.1 | C3.1 62.23,69.22 64.71,69.22 U3.1 | C4.1 81.28,69.22 83.76,69.22 U4.1 | C9.1 39.37,19.68 36.89,19.68 U5.1 | C10.1 58.42,19.68 55.94,19.68 U6.1 | C11.1 77.47,19.68 74.99,19.68 U7.1 | C12.1 96.52,19.68 94.04,19.68 U8.1
  Top 0.61: v34.29,17.78 36.89,17.78 36.89,19.68 | v53.34,17.78 55.94,17.78 55.94,19.68 | 74.99,19.68 74.99,17.78 v73.66,17.78 v72.39,17.78 | v91.44,17.78 94.04,17.78 94.04,19.68 | v29.21,71.12 26.61,71.12 26.61,69.22 | v48.26,71.12 45.66,71.12 45.66,69.22 | v67.31,71.12 64.71,71.12 64.71,69.22 | v86.36,71.12 83.76,71.12 83.76,69.22
  Top 1.016: v11.43,16.51 11.43,17.78 3.81,17.78 arc-90 3.62,17.97 15VDC.VIN0
  Bottom 1.016: v54.61,17.78 v55.88,17.78 | v72.39,17.78 v73.66,17.78 | v73.66,17.78 v74.93,17.78 | v91.44,17.78 v92.71,17.78 | v92.71,17.78 v93.98,17.78 | v15.24,15.24 v15.24,13.97 v13.97,13.97 | v15.24,15.24 v15.24,16.51 | v15.24,16.51 v13.97,16.51 | v13.97,16.51 v12.7,16.51 | v12.7,16.51 v11.43,16.51 v11.43,15.24 | v11.43,15.24 v11.43,13.97 v12.7,13.97 | v12.7,13.97 v13.97,13.97 | v11.43,15.24 v12.7,15.24 | v12.7,15.24 v13.97,15.24 | v13.97,15.24 v15.24,15.24 | v12.7,15.24 v12.7,13.97 | v13.97,16.51 v13.97,15.24 | v13.97,15.24 v13.97,13.97 | v12.7,16.51 v12.7,15.24 | v13.97,15.24 arc90 v15.24,16.51 | v34.29,17.78 v35.56,17.78 | v35.56,17.78 v36.83,17.78 | v26.67,71.12 v27.94,71.12 | v27.94,71.12 v29.21,71.12 | v45.72,71.12 v46.99,71.12 | v46.99,71.12 v48.26,71.12 | v64.77,71.12 v66.04,71.12 | v66.04,71.12 v67.31,71.12 | v86.36,71.12 v85.09,71.12 | v85.09,71.12 v83.82,71.12 | v15.24,16.51 15.24,21.59 35.56,21.59 | 35.56,21.59 54.61,21.59 | 54.61,21.59 73.66,21.59 | 73.66,21.59 92.71,21.59 | 85.09,67.31 96.52,67.31 96.52,21.59 92.71,21.59 | 85.09,67.31 66.04,67.31 | 66.04,67.31 46.99,67.31 | 46.99,67.31 27.94,67.31 | 27.94,67.31 24.13,67.31 | v27.94,71.12 27.94,67.31 | v46.99,71.12 46.99,67.31 | v66.04,71.12 66.04,67.31 | v85.09,71.12 85.09,67.31 | v35.56,17.78 35.56,21.59 | v53.34,17.78 v54.61,17.78 | v54.61,17.78 54.61,21.59 | 92.71,21.59 v92.71,17.78 | v73.66,17.78 73.66,21.59
  pour Bottom (no thermals): 1.27,8.89 1.27,22.86 24.13,22.86 24.13,87.63 92.71,87.63 92.71,78.74 97.79,78.74 97.79,10.16 91.44,10.16 91.44,1.27 24.13,1.27 24.13,8.89

### Text on the board
tNames: Property of Microsoft Research | Research Prototype - Not for Sale | 15VDC, 4A | 2.1mm, center + | PumpSpark V0.2